# EAGLE design sim800V2 (EAGLE 9.2.2)

## Sheet 1 of 3
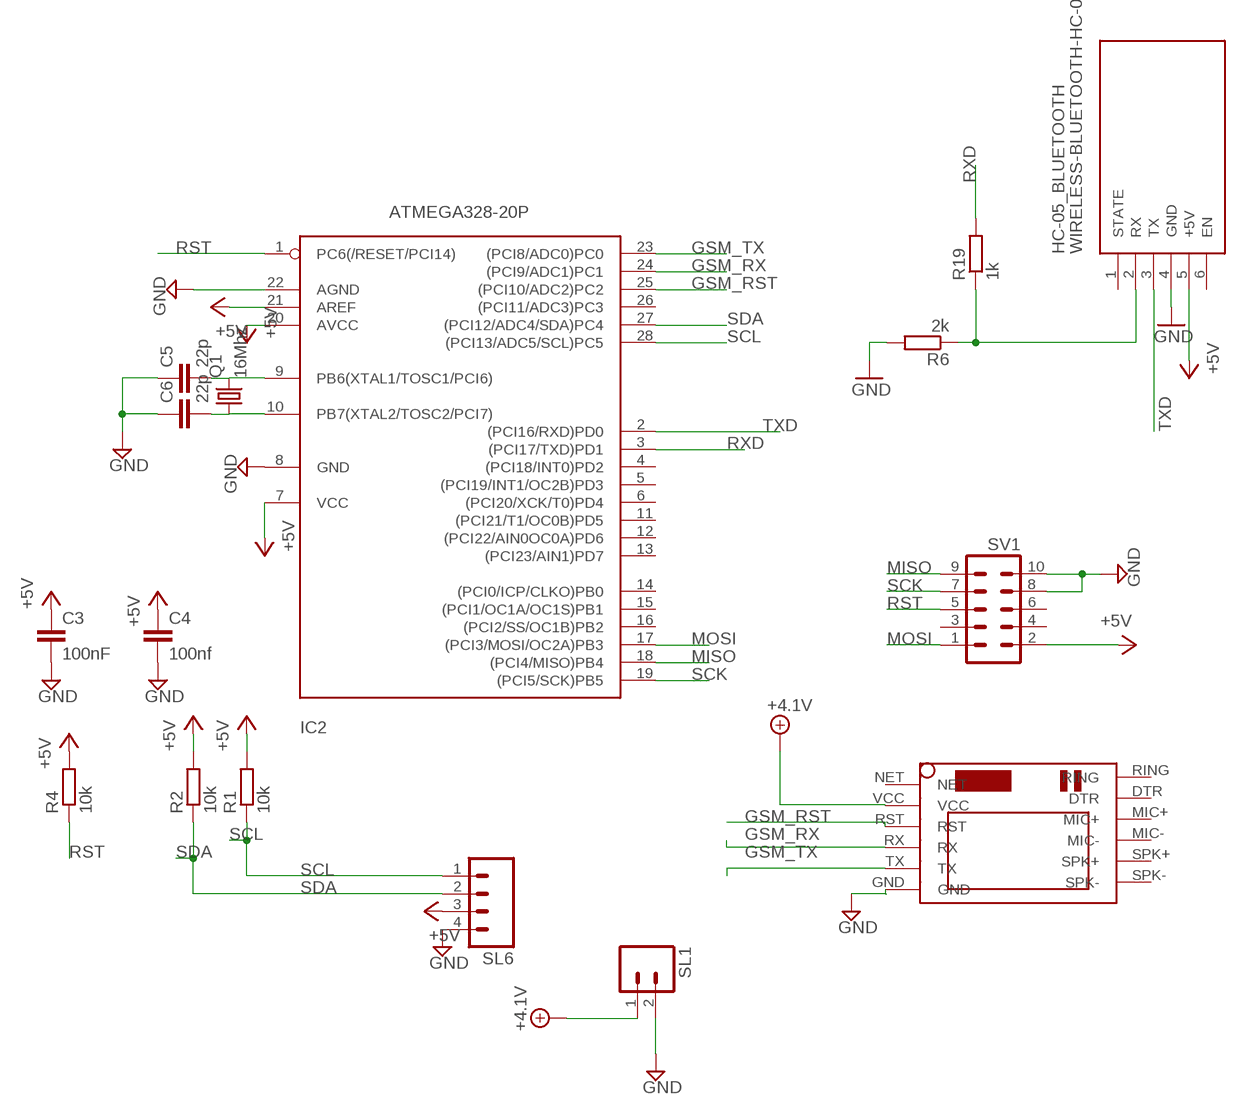
[diagram p0: schematic, sheet 1]

### Parts
C3  100nF  C-EU050-025X075  [C050-025X075]
C4  100nf  C-EU050-025X075  [C050-025X075]
C5  22p  C-EU025-025X050  [C025-025X050]
C6  22p  C-EU025-025X050  [C025-025X050]
HC-05_BLUETOOTH  WIRELESS-BLUETOOTH-HC-05  [WIRELESS-BLUETOOTH-HC-05]
IC2  ATMEGA328-20P  [DIL28-3]
Q1  16Mhz  CRYSTALHC49U-V  [HC49U-V]
R1  10k  R-EU_0207/10  [0207/10]
R2  10k  R-EU_0207/10  [0207/10]
R4  10k  R-EU_0207/10  [0207/10]
R6  2k  R-EU_R0805  [R0805]
R19  1k  R-EU_R0805  [R0805]
SL1  M02  [02P]
SL6  M04  [04P]
SV1  ML10  [ML10]
U$1  SIM800LMODULE  [SIM800LMODULE]

### Nets
+4.1V: SL1.1 U$1.VCC ; also sheet 3
+5V: C3.1 C4.1 HC-05_BLUETOOTH.5(+5V) IC2.7(VCC) IC2.20(AVCC) IC2.21(AREF) R1.2 R2.2 R4.2 SL6.3 SV1.2 ; also sheet 3
GND: C3.2 C4.2 C5.1 C6.1 HC-05_BLUETOOTH.4(GND) IC2.8(GND) IC2.22(AGND) R6.2 SL1.2 SL6.4 SV1.8 SV1.10 U$1.GND ; also sheet 2,3
GSM_RST: IC2.25((PCI10/ADC2)PC2) U$1.RST
GSM_RX: IC2.24((PCI9/ADC1)PC1) U$1.RX
GSM_TX: IC2.23((PCI8/ADC0)PC0) U$1.TX
MISO: IC2.18((PCI4/MISO)PB4) SV1.9 ; also sheet 2
MOSI: IC2.17((PCI3/MOSI/OC2A)PB3) SV1.1 ; also sheet 2
N$1: C5.2 IC2.9(PB6(XTAL1/TOSC1/PCI6)) Q1.2
N$2: C6.2 IC2.10(PB7(XTAL2/TOSC2/PCI7)) Q1.1
N$3: HC-05_BLUETOOTH.2(RX) R6.1 R19.1
RST: IC2.1(PC6(/RESET/PCI14)) R4.1 SV1.5
RXD: IC2.3((PCI17/TXD)PD1) R19.2
SCK: IC2.19((PCI5/SCK)PB5) SV1.7 ; also sheet 2
SCL: IC2.28((PCI13/ADC5/SCL)PC5) R1.1 SL6.1
SDA: IC2.27((PCI12/ADC4/SDA)PC4) R2.1 SL6.2
TXD: HC-05_BLUETOOTH.3(TX) IC2.2((PCI16/RXD)PD0)
Unconnected: HC-05_BLUETOOTH.1(STATE) HC-05_BLUETOOTH.6(EN) IC2.4((PCI18/INT0)PD2) IC2.5((PCI19/INT1/OC2B)PD3) IC2.6((PCI20/XCK/T0)PD4) IC2.11((PCI21/T1/OC0B)PD5) IC2.12((PCI22/AIN0OC0A)PD6) IC2.13((PCI23/AIN1)PD7) IC2.14((PCI0/ICP/CLKO)PB0) IC2.15((PCI1/OC1A/OC1S)PB1) IC2.16((PCI2/SS/OC1B)PB2) IC2.26((PCI11/ADC3)PC3) SV1.3 SV1.4 SV1.6 U$1.DTR U$1.MIC+ U$1.MIC- U$1.NET U$1.RING U$1.SPK+ U$1.SPK-

## Sheet 2 of 3
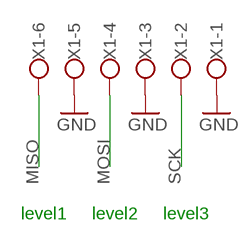
[diagram p1: schematic, sheet 2]

### Parts
X1  W237-136  [W237-136]

### Nets
GND: X1.1 X1.3 X1.5 ; also sheet 1,3
MISO: X1.6 ; also sheet 1
MOSI: X1.4 ; also sheet 1
SCK: X1.2 ; also sheet 1

### Notes on the sheet
- level1 | level2 | level3

## Sheet 3 of 3
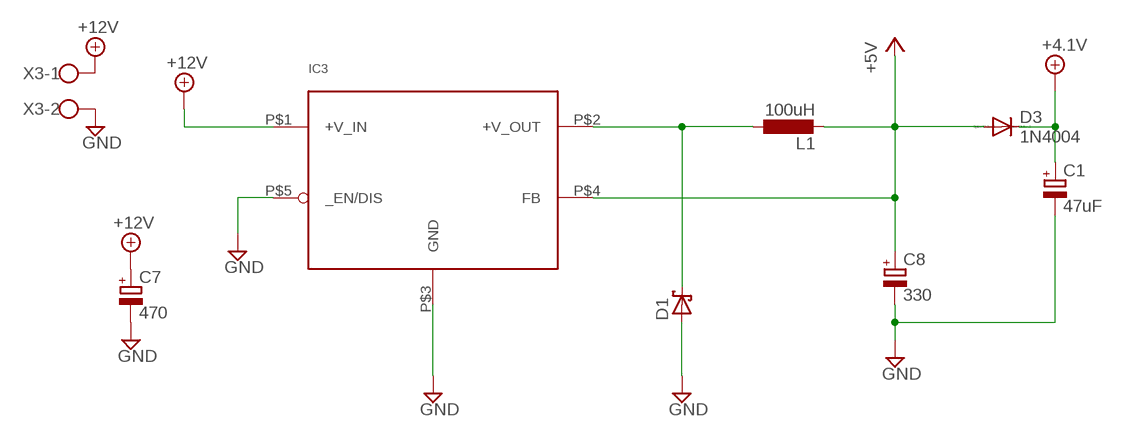
[diagram p2: schematic, sheet 3]

### Parts
C1  47uF  CPOL-EUE2.5-6  [E2,5-6]
C7  470  CPOL-EUE3.5-8  [E3,5-8]
C8  330  CPOL-EUE3.5-8  [E3,5-8]
D1  SCHOTTKY-DIODESMD  [SMB]
D3  1N4004  [DO41-10]
IC3  LM2576-T05D  [TO220-5_STAGGERED]
L1  100uH  L-EU6000-XXX-RC  [6000-XXXX-RC]
X3  W237-102  [W237-102]

### Nets
+4.1V: C1.+ D3.C ; also sheet 1
+5V: C8.+ D3.A IC3.P$4(FB) L1.2 ; also sheet 1
+12V: C7.+ IC3.P$1(+V_IN) X3.1
GND: C1.- C7.- C8.- D1.A IC3.P$3(GND) IC3.P$5(_EN/DIS) X3.2 ; also sheet 1,2
N$4: D1.C IC3.P$2(+V_OUT) L1.1

## Library data of the parts
C1 = rcl:CPOL-EU: POLARIZED CAPACITOR, European symbol; SPICEPREFIX: C
C3-C6 = rcl:C-EU: CAPACITOR, European symbol
C7 C8 = rcl:CPOL-EU: POLARIZED CAPACITOR, European symbol
D1 = diode:SCHOTTKY-DIODE: Schottky Diode
D3 = diode:1N4004: DIODE general purpose rectifier, 1 A
HC-05_BLUETOOTH = diy-modules:WIRELESS-BLUETOOTH-HC-05: Bluetooth Transceiver Module based on HC-05 board Tutorial is available here: https://arduino-info.wikispaces.com/BlueTooth-HC05-HC06-Modules-How-To Click here to find device on ebay.com <http://www.ebay.com/sch/hc-05+module+rs232>
IC2 = atmega328:ATMEGA328*P: MICROCONTROLLER 32 kBytes FLASH 2 kBytes SRAM 1 kBytes EEPROM USART 8-channel 10 bit ADC
IC3 = LM2576:LM2576-T05D: LM2576/LM2576HV Series SIMPLE SWITCHER® 3A Step-Down Voltage Regulator STAGGERED PACKAGE
L1 = rcl:L-EU: INDUCTOR, European symbol
Q1 = crystal:CRYSTAL: CRYSTAL; OC_FARNELL: 1666969; OC_NEWARK: unknown
R1 R2 R4 = rcl:R-EU_: RESISTOR, European symbol; SPICEPREFIX: R
R6 R19 = rcl:R-EU_: RESISTOR, European symbol
SL1 = con-amp-quick:M02: AMP QUICK CONNECTOR; OC_FARNELL: unknown; OC_NEWARK: unknown
SL6 = con-amp-quick:M04: AMP QUICK CONNECTOR; OC_FARNELL: unknown; OC_NEWARK: unknown
SV1 = con-harting-ml:ML10: HARTING; OC_FARNELL: unknown; OC_NEWARK: unknown
U$1 = SIM800LMODULE:SIM800LMODULE: SIM800L Module
X1 = con-wago-500:W237-136: WAGO SCREW CLAMP; MPN: 237-136; OC_FARNELL: unknown; OC_NEWARK: 84K9151
X3 = con-wago-500-edit:W237-102: WAGO SCREW CLAMP; MPN: 237-102; OC_FARNELL: unknown; OC_NEWARK: 70K9898

## Net classes
0 default: width 0.152 mm, drill 0.152 mm, clearance 0.381 mm

## Board
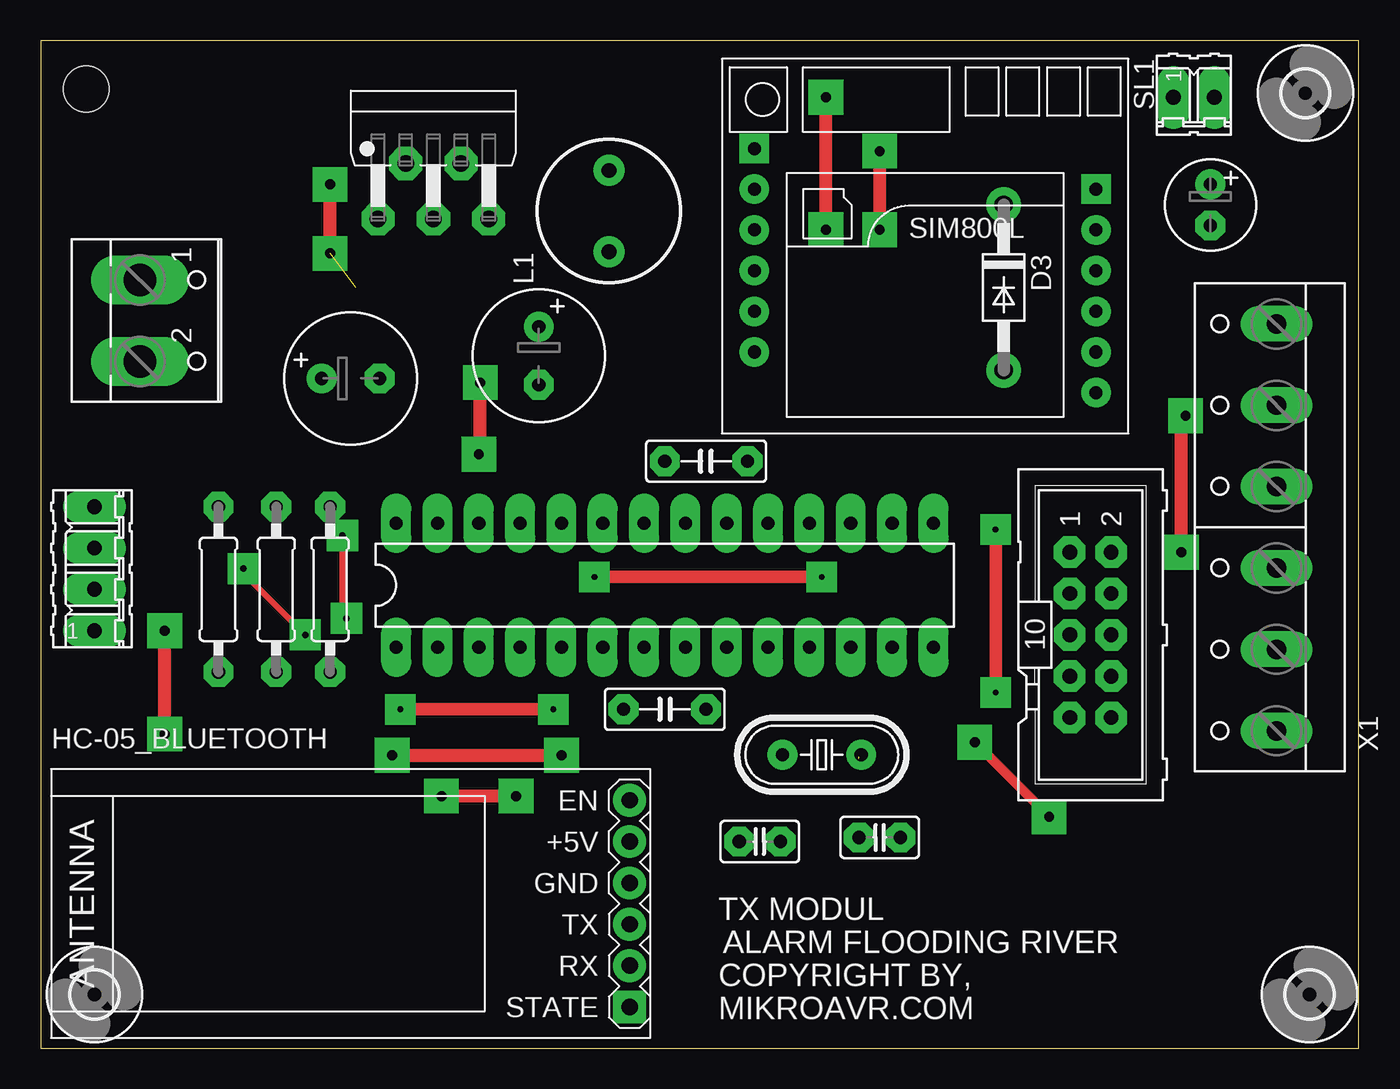
[diagram p3: board, top side]
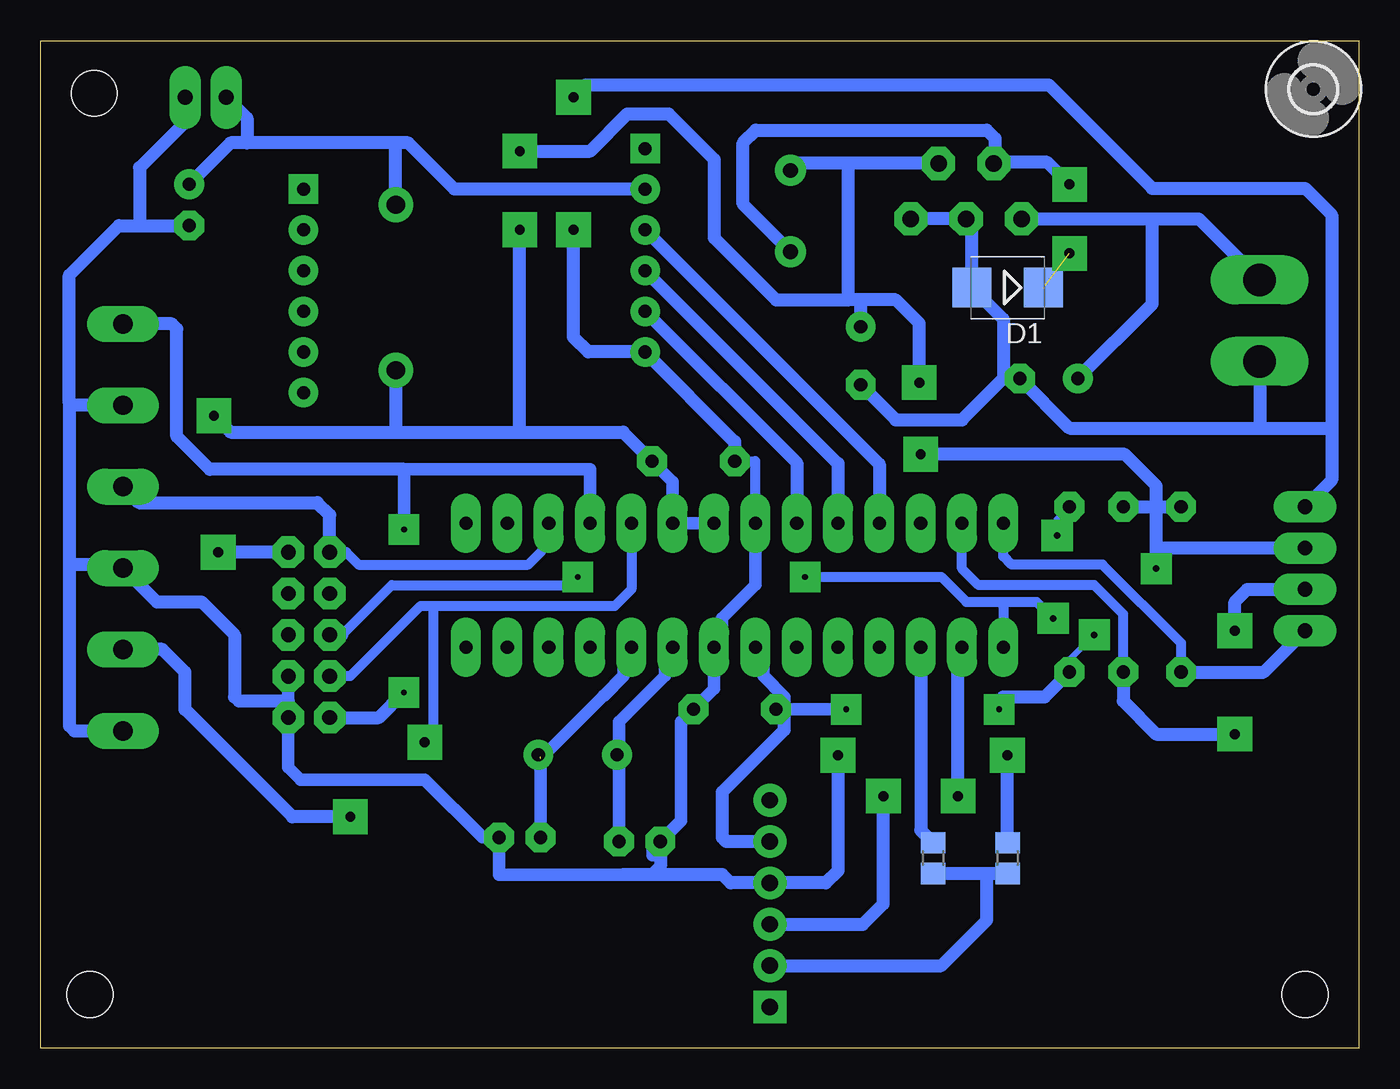
[diagram p4: board, bottom side, seen from below]

Size 81.01 x 61.9 mm. Coordinates in mm from the lower left corner, seen from the top.
Outline: 0,0 81.01,0 81.01,61.9 0,61.9 0,0
Copper layers (1*16): Top 0.035mm / dielectric 1.5mm / Bottom 0.035mm
Design rules "setting *": minimum track width 16mil, minimum drill 24mil, track to track 8mil, track to pad 8mil, pad to pad 8mil, via to via 8mil, smd to smd 8mil, copper to edge 50mil, drill to drill 30mil, minimum pad ring 20mil, minimum via ring 30mil, stop-mask expansion 0mil, vias tented up to drill 0mil, thermal gap 10mil

### Footprints (pad centres in the part's own frame; a part is rotated, then mirrored left to right if it is on the bottom)
E2,5-6 = drill 0.813 pad 1.6: + -1.27,0 | drill 0.813 pad 1.6 octagon: - 1.27,0
C050-025X075 = drill 0.813 octagon: 1 -2.54,0; 2 2.54,0
C025-025X050 = drill 0.813 octagon: 1 -1.27,0; 2 1.27,0
E3,5-8 = drill 0.813 pad 1.6: + -1.778,0 | drill 0.813 pad 1.6 octagon: - 1.778,0
SMB = smd 2.4 x 2.4: A 2.2,0; C -2.2,0
DO41-10 = drill 1.118: A 5.08,0; C -5.08,0
WIRELESS-BLUETOOTH-HC-05 = drill 1 square: 1 -6.35,-17.145 | drill 1: 2 -3.81,-17.145; 3 -1.27,-17.145; 4 1.27,-17.145; 5 3.81,-17.145; 6 6.35,-17.145
DIL28-3 = drill 0.813 long: 1 -16.51,-3.81; 2 -13.97,-3.81; 3 -11.43,-3.81; 4 -8.89,-3.81; 5 -6.35,-3.81; 6 -3.81,-3.81; 7 -1.27,-3.81; 8 1.27,-3.81; 9 3.81,-3.81; 10 6.35,-3.81; 11 8.89,-3.81; 12 11.43,-3.81; 13 13.97,-3.81; 14 16.51,-3.81; 15 16.51,3.81; 16 13.97,3.81; 17 11.43,3.81; 18 8.89,3.81; 19 6.35,3.81; 20 3.81,3.81; 21 1.27,3.81; 22 -1.27,3.81; 23 -3.81,3.81; 24 -6.35,3.81; 25 -8.89,3.81; 26 -11.43,3.81; 27 -13.97,3.81; 28 -16.51,3.81
TO220-5_STAGGERED = drill 1.016 octagon: P$1 -3.404,-3.404; P$2 -1.702,0; P$3 0,-3.404; P$4 1.702,0; P$5 3.404,-3.404
6000-XXXX-RC = drill 0.9 pad 1.422: 1 -2.5,0; 2 2.5,0
HC49U-V = drill 0.813: 1 -2.413,0; 2 2.413,0
0207/10 = drill 0.813 octagon: 1 -5.08,0; 2 5.08,0
R0805 = smd 1.3 x 1.5: 1 -0.95,0; 2 0.95,0
02P = drill 0.914 long: 1 -1.27,0; 2 1.27,0
04P = drill 0.914 long: 1 -3.81,0; 2 -1.27,0; 3 1.27,0; 4 3.81,0
ML10 = drill 0.914 octagon: 1 -5.08,-1.27; 2 -5.08,1.27; 3 -2.54,-1.27; 4 -2.54,1.27; 5 0,-1.27; 6 0,1.27; 7 2.54,-1.27; 8 2.54,1.27; 9 5.08,-1.27; 10 5.08,1.27
SIM800LMODULE = drill 0.8: DTR 10.5,1; GND -10.5,-6.5; MIC+ 10.5,-1.5; MIC- 10.5,-4; RST -10.5,1; RX -10.5,-1.5; SPK+ 10.5,-6.5; SPK- 10.5,-9; TX -10.5,-4; VCC -10.5,3.5 | drill 0.8 square: NET -10.5,6; RING 10.5,3.5
2,8 = hole 2.8: 0,0
W237-136 = drill 1.194 long: 1 -12.5,-1.27; 2 -7.5,-1.27; 3 -2.5,-1.27; 4 2.5,-1.27; 5 7.5,-1.27; 6 12.5,-1.27
W237-102 = drill 2 long: 1 -2.5,-1.27; 2 2.5,-1.27

### Placement (x,y rotation side)
C1  71.88,51.82 270 top
C3  38.35,20.83 0 top
C4  40.89,36.07 180 top
C5  44.2,12.7 0 top
C6  51.56,12.95 180 top
C7  19.05,41.15 0 top
C8  30.61,42.55 270 top
D1  21.59,46.74 180 bottom
D3  59.18,46.74 270 top
HC-05_BLUETOOTH  19.05,8.89 90 top
IC2  38.35,28.45 0 top
IC3  24.13,54.36 0 top
L1  34.93,51.43 90 top
Q1  48.01,18.03 180 top
R1  10.92,28.19 90 top
R2  14.48,28.19 90 top
R4  17.78,28.19 270 top
R6  21.59,11.68 90 bottom
R19  26.16,11.68 90 bottom
SL1  70.87,58.42 0 top
SL6  3.3,29.46 90 top
SV1  64.52,25.4 270 top
U$1  54.36,49.28 0 top
U$2  [2,8]  77.98,3.3 0 top
U$3  [2,8]  77.72,58.67 0 top
U$4  [2,8]  2.79,58.93 0 bottom
U$5  [2,8]  3.3,3.3 0 top
X1  74.68,32 90 top
X3  7.37,44.7 270 top

### Tracks (layer width: path | path; a pad name or v marks a point on that pad's centre or on a via)
+4.1V
  Bottom 0.813: U$1.VCC 55.57,52.78 58.42,55.63 59.18,55.63 | 59.18,55.63 68.33,55.63 | 68.33,55.63 69.34,55.63 C1.+ | SL1.1 68.33,57.15 68.33,55.63 | D3.C 59.18,55.63
+5V  (via drill 0.35, 0.4, 0.61)
  Top 0.406: v16.26,25.4 12.45,29.21 v12.45,29.46
  Top 0.762: v31.5,20.83 v22.1,20.83
  Top 0.813: v70.1,30.48 70.1,38.61 v70.36,38.86 | v26.92,36.49 27.01,36.58 v27.01,40.89 | v51.56,50.29 v51.56,55.12
  Bottom 0.406: R4.2 17.78,23.88 v16.26,25.4 | v12.45,29.46 12.45,29.72 12.19,29.97 | 59.18,38.1 59.44,37.85
  Bottom 0.61: 12.45,33.02 12.45,33.27
  Bottom 0.762: C3.1 35.31,20.83 | 35.31,20.83 v31.5,20.83 | IC2.7 36.6,24.15 36.6,22.87 35.31,21.58 35.31,20.83 | C4.1 42.16,34.8 IC2.20 IC2.21
  Bottom 0.813: v22.1,20.83 21.34,21.59 | 21.84,21.59 21.34,21.59 | 21.34,21.59 19.3,21.59 R4.2 | R2.2 12.45,33.27 R1.2 | 12.45,29.72 12.45,30.73 | 12.45,30.73 12.45,33.02 12.45,34.54 14.39,36.49 v26.92,36.49 | SV1.2 v70.1,30.48 | C4.1 45.21,37.85 51.82,37.85 | v70.36,38.86 69.34,37.85 59.44,37.85 51.82,37.85 | IC3.P$4 31.5,54.36 | 31.5,54.36 34.5,54.36 L1.2 | C8.+ 30.61,45.97 | 31.37,45.97 31.37,54.23 31.5,54.36 | v27.01,40.89 27.01,44.54 28.45,45.97 30.61,45.97 | 30.61,45.97 31.37,45.97 | 51.82,37.85 51.56,38.1 v51.56,50.29 | v51.56,55.12 47.24,55.12 44.96,57.4 42.42,57.4 39.62,54.61 39.62,49.78 35.81,45.97 31.37,45.97 | 35.31,20.83 35.31,19.56 39.12,15.75 39.12,12.95 38.86,12.7 HC-05_BLUETOOTH.5 | SL6.3 12.45,30.73 | D3.A 59.18,38.1
+12V
  Bottom 0.813: X3.1 9.84,50.95 12.7,50.95 | IC3.P$1 12.7,50.95 | C7.+ 12.7,45.72 12.7,50.95
GND  (via drill 0.61)
  Top 0.813: v48.26,50.29 v48.26,58.42 | v21.59,18 v32,18
  Bottom 0.61: IC2.22 37.08,36.07 C4.2
  Bottom 0.762: 43.41,11.85 43.41,12.22 C5.1 41.66,13.97 41.66,20.07 C3.2 39.62,22.1 IC2.8 39.14,25.12 39.14,26.4 37.08,28.46 IC2.22 | 44.59,10.67 45.21,10.67 52.83,10.67 C6.1 53.85,12.95 57.4,16.51 65.02,16.51 65.79,17.27 SV1.10 65.79,21.34 SV1.8
  Bottom 0.813: 79.25,39.62 79.25,29.72 | 79.25,29.72 79.25,19.81 78.94,19.5 X1.1 | 79.25,29.72 76.16,29.72 X1.3 73.87,27.43 71.12,27.43 69.09,25.4 69.09,21.59 68.83,21.34 65.79,21.34 | C4.2 38.35,37.27 U$1.GND 47.35,42.78 48.26,43.69 v48.26,50.29 | C8.- 28.45,38.61 24.38,38.61 21.84,41.15 | D1.A 23.79,50.61 IC3.P$3 IC3.P$5 | 24.38,46.14 D1.A | 79.25,39.62 79.25,47.5 76.2,50.55 74.93,50.55 | 74.93,50.55 C1.- | 79.25,39.62 79.13,39.5 X1.5 | v48.26,58.42 47.5,59.18 19.05,59.18 12.7,52.83 3.3,52.83 1.68,51.21 1.68,38.1 | R6.2 v21.59,18 | v32,18 32,10.92 32.77,10.16 HC-05_BLUETOOTH.4 38.61,10.16 39.12,10.67 43.43,10.67 | 43.43,10.67 45.21,10.67 | C5.1 42.93,11.18 43.43,10.67 | 21.84,41.15 C7.- 17.78,38.1 6.1,38.1 | D1.A 21.84,44.79 21.84,41.15 | SL6.4 1.68,34.9 1.68,38.1 | 6.1,38.1 1.68,38.1 | X3.2 6.1,38.1 | 74.93,50.55 74.93,54.1 72.14,56.9 SL1.2
GSM_RST
  Bottom 0.813: U$1.RST 29.46,35.88 IC2.25
GSM_RX
  Bottom 0.813: U$1.RX 32,35.92 IC2.24
GSM_TX
  Bottom 0.813: U$1.TX 34.54,35.96 IC2.23
MISO  (via drill 0.35)
  Top 0.762: v58.69,21.86 58.69,31.86 v58.67,31.88
  Bottom 0.762: 58.67,33.02 v58.67,31.88 58.67,35.56 47.24,35.56 IC2.18
  Bottom 0.813: SV1.9 60.23,20.32 v58.69,21.86 | X1.6 72.95,44.5 72.64,44.2 72.64,37.59 70.61,35.56 58.67,35.56
MOSI
  Bottom 0.406: 50.27,31.77 50.27,30.49
  Bottom 0.61: 50.27,30.49 51.04,29.72 61.47,29.72 62.23,30.48 SV1.1
  Bottom 0.762: IC2.17 50.27,31.77
  Bottom 0.813: SV1.1 63.25,32.77 64.01,33.53 74.97,33.53 X1.4
N$1
  Bottom 0.762: C5.2 45.47,18.29 | 45.47,18.29 45.59,18.41 | 45.72,18.54 45.59,18.41 | 45.59,18.41 Q1.2 | IC2.9 42.65,24.15 42.65,22.87 45.47,20.05 45.47,18.29
N$2  (1 unrouted)
  Bottom 0.762: C6.2 50.29,17.78 46.41,21.67 46.39,21.67 45.19,22.87 45.19,24.15 IC2.10 | 50.29,17.91 Q1.1
N$3
  Bottom 0.813: R6.1 22.86,10.73 | 22.86,10.73 R19.1 | HC-05_BLUETOOTH.2 25.65,5.08 22.86,7.87 22.86,10.73
N$4  (via drill 0.61)  (1 unrouted)
  Top 0.813: v17.78,48.83 v17.78,53.07
  Bottom 0.813: L1.1 37.85,51.86 37.85,55.63 37.06,56.41 22.86,56.41 22.35,55.91 22.35,54.43 | 22.35,54.43 IC3.P$2 | v17.78,53.07 19.14,54.43 22.35,54.43
RST  (via drill 0.35, 0.4)
  Top 0.406: v18.8,26.42 18.54,26.67 v18.54,31.5
  Top 0.762: v48.01,28.96 v34.04,28.96
  Bottom 0.406: 48.77,28.45 48.26,28.96 v48.01,28.96 | 22.1,27.43 21.84,27.18 | v18.54,31.5 18.54,32.51 R4.1
  Bottom 0.61: 62.48,25.4 59.44,28.45 48.77,28.45 | v34.04,28.96 25.65,28.96 24.13,27.43 22.1,27.43 19.81,27.43 v18.8,26.42 | 21.84,27.18 IC2.1
  Bottom 0.762: 21.46,25.02 IC2.1 | SV1.5 62.48,25.4
RXD
  Bottom 0.813: IC2.3 26.92,13.4 R19.2
SCK  (via drill 0.61)
  Top 0.61: v57.4,18.8 v61.98,14.22
  Bottom 0.61: IC2.19 44.7,28.19 45.72,27.18 56.9,27.18 | SV1.7 61.98,22.86 57.66,27.18 56.9,27.18 | 56.9,27.18 56.9,19.3
  Bottom 0.762: 56.9,19.3 v57.4,18.8
  Bottom 0.813: v61.98,14.22 65.53,14.22 72.14,20.83 72.14,23.11 73.53,24.5 X1.2
SCL
  Bottom 0.61: R1.1 10.92,24.89 15.75,29.72 21.34,29.72 21.84,30.23 IC2.28
  Bottom 0.813: R1.1 5.84,23.11 SL6.1
SDA  (via drill 0.61)
  Top 0.813: v7.62,19.3 v7.62,25.65
  Bottom 0.61: R2.1 14.48,26.67 16.26,28.45 23.37,28.45 24.38,29.46 IC2.27
  Bottom 0.813: R2.1 14.48,21.34 12.45,19.3 v7.62,19.3 | v7.62,25.65 7.62,27.43 6.86,28.19 SL6.2
TXD  (via drill 0.61)
  Top 0.813: v29.22,15.49 v24.63,15.49
  Bottom 0.813: HC-05_BLUETOOTH.3 30.48,7.62 29.22,8.88 v29.22,15.49 | v24.63,15.49 24.63,24.39 IC2.2

### Text on the board
tPlace: TX MODUL | ALARM FLOODING RIVER | COPYRIGHT BY, | MIKROAVR.COM